# EasyEDA Pro project STLINK1.eprj

# Schematic 自制ST-LINK V2-1（开源版本）
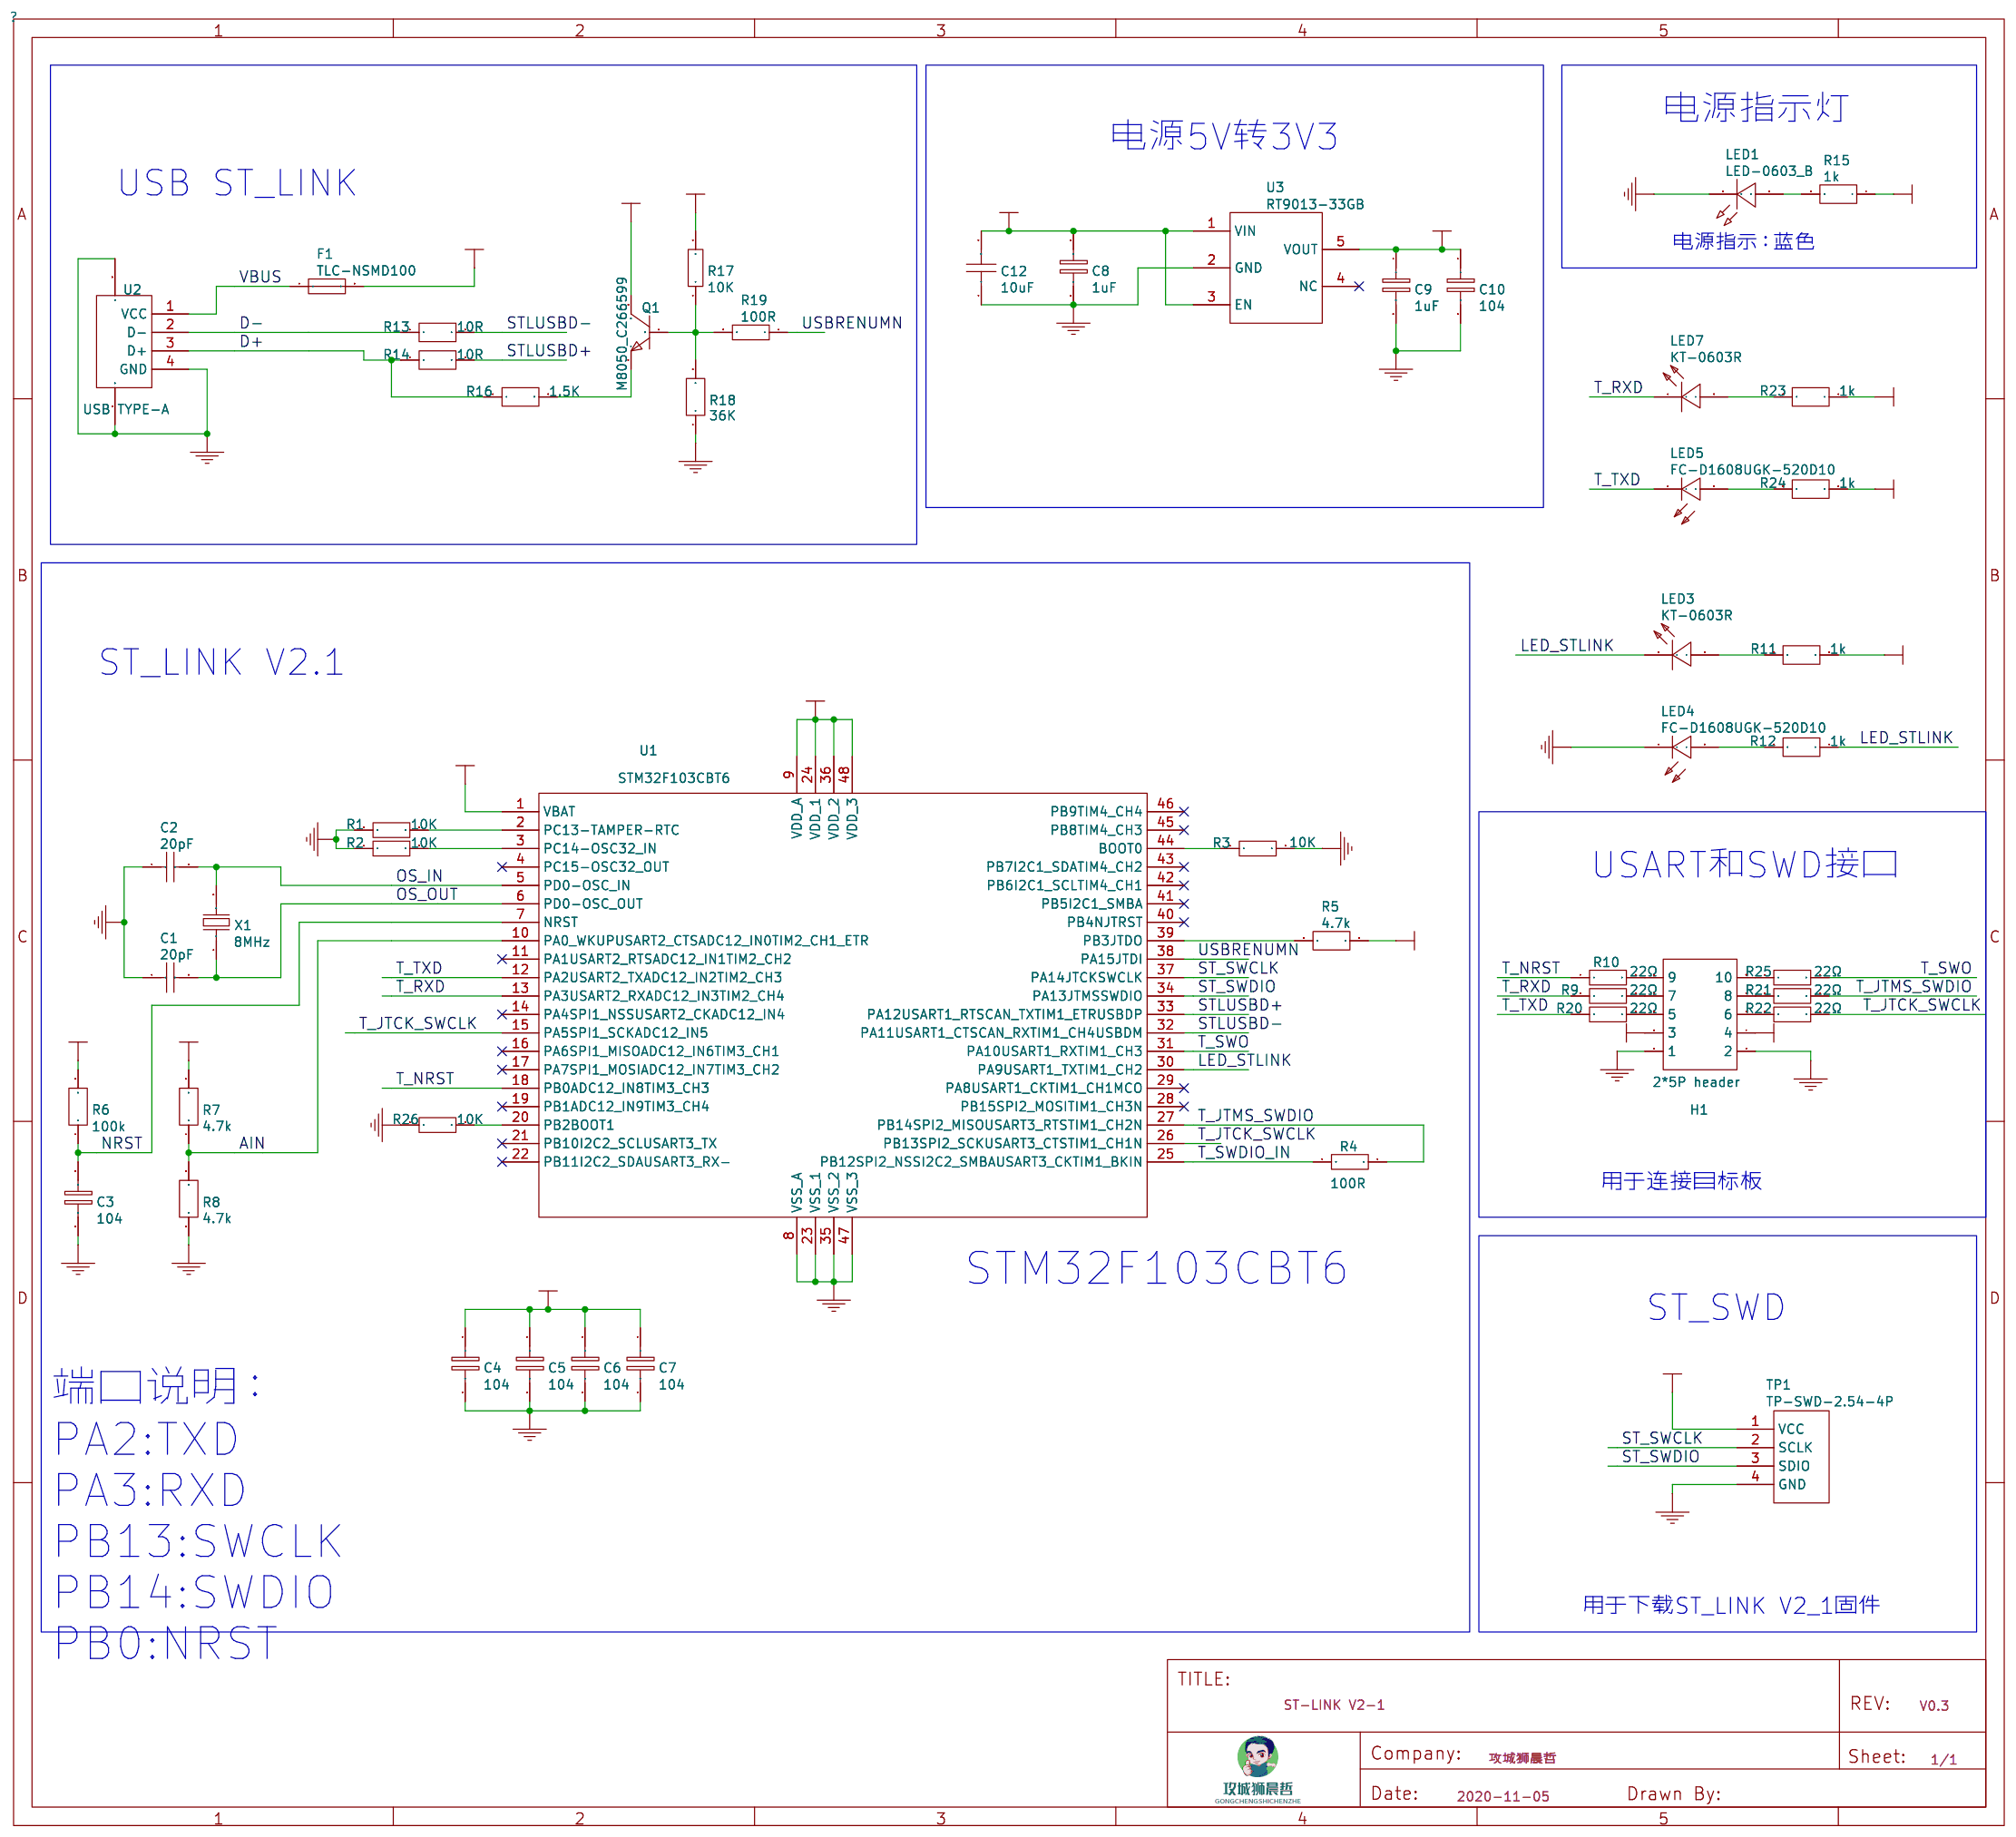
[diagram p0: schematic sheet]

## Parts
C1  20pF  [C0603]
C2  20pF  [C0603]
C3  104  [C0603]
C4  104  [C0603]
C5  104  [C0603]
C6  104  [C0603]
C7  104  [C0603]
C8  1uF  [C0603]
C9  1uF  [C0603]
C10  104  [C0603]
C12  10uF  [C0603]
F1  TLC-NSMD100  [R1206]
H1  2*5P header
LED1  LED-0603_B  [LED0603_BLUE]
LED3  KT-0603R  [LED0603-RD]
LED4  FC-D1608UGK-520D10  [LED0603-RD]
LED5  FC-D1608UGK-520D10  [LED0603-RD]
LED7  KT-0603R  [LED0603-RD]
Q1  M8050_C266599
R1  10K  [R0603]
R2  10K  [R0603]
R3  10K  [R0603]
R4  100R  [R0603]
R5  4.7k  [R0603]
R6  100k  [R0603]
R7  4.7k  [R0603]
R8  4.7k  [R0603]
R9  22Ω  [R0603]
R10  22Ω  [R0603]
R11  1k  [R0603]
R12  1k  [R0603]
R13  10R  [R0603]
R14  10R  [R0603]
R15  1k  [R0603]
R16  1.5K  [R0603]
R17  10K  [R0603]
R18  36K  [R0603]
R19  100R  [R0603]
R20  22Ω  [R0603]
R21  22Ω  [R0603]
R22  22Ω  [R0603]
R23  1k  [R0603]
R24  1k  [R0603]
R25  22Ω  [R0603]
R26  10K  [R0603]
TP1  TP-SWD-2.54-4P
U1  STM32F103CBT6
U2  USB TYPE-A
U3  RT9013-33GB  [SOT-23-5_L3.0-W1.7-P0.95-LS2.8-BR]
X1  8MHz  [OSC-SMD_L5.0-W3.2]

## Library data of the parts
C1 C2 = 20pF: Supplier: LCSC; Manufacturer Part: CL10C220JB8NNNC; Manufacturer: SAMSUNG; Supplier Part: C1653; JLCPCB Part Class: Basic
C3-C7 C10 = 104: Manufacturer Part: AC0603KRX7R9BB104; Supplier: LCSC; Manufacturer: YAGEO; Supplier Part: C149620
C8 = 1uF: Supplier: LCSC; Manufacturer: YAGEO; Supplier Part: C14664
C9 = 1uF: Manufacturer Part: CC0603KRX5R8BB105; Supplier: LCSC; Manufacturer: YAGEO; Supplier Part: C14664
C12 = 10uF: Supplier: LCSC; Manufacturer: SAMSUNG(三星); Manufacturer Part: CL10A106MA8NRNC; Supplier Part: C96446; JLCPCB Part Class: Basic Part
F1 = TLC-NSMD100: Supplier: LCSC; Supplier Part: C261954; Manufacturer: TLC Electronic
H1 = 2*5P header: Supplier: LCSC; Manufacturer: MINTRON; Manufacturer Part: MTP125-205R1; image: //image.lceda.cn/szlcsc/C60563.jpg; Supplier Part: C358707
LED1 = LED-0603_B: Manufacturer: EVERLIGHT(台湾亿光); Manufacturer Part: 19-217/BHC-ZL1M2RY/3T; Supplier Part: C72041; Supplier: LCSC
LED3 LED7 = KT-0603R: Supplier: LCSC; Manufacturer: KENTO; Supplier Part: C2286; JLCPCB Part Class: Basic Part
LED4 LED5 = FC-D1608UGK-520D10: Supplier: LCSC; Manufacturer: 国星光电; Manufacturer Part: NCD0603G1; Supplier Part: C84267; JLCPCB Part Class: Extended Part
Q1 = M8050_C266599: Supplier: LCSC; Supplier Part: C266599; Manufacturer: Bourne Semicon (Shenzhen); Manufacturer Part: M8050; JLCPCB Part Class: Extend
R1-R3 R17 R26 = 10K: Supplier: LCSC; Manufacturer: YAGEO; Manufacturer Part: AC0603FR-0710KL; Supplier Part: C116677
R4 R19 = 100R: Supplier: LCSC; Supplier Part: C105588; Manufacturer: YAGEO; Manufacturer Part: RC0603FR-07100RL
R5 R7 R8 = 4.7k: Manufacturer Part: AC0603FR-074K7L; Supplier: LCSC; Manufacturer: YAGEO; Supplier Part: C116697
R6 = 100k: Manufacturer Part: AC0603FR-07100KL; Supplier: LCSC; Manufacturer: YAGEO; Supplier Part: C116674
R9 R10 R20-R22 R25 = 22Ω: Supplier: LCSC; Manufacturer: UNI-ROYAL(厚声); Manufacturer Part: 0603WAF220JT5E; Supplier Part: C23345; JLCPCB Part Class: Basic Part
R11 R12 R15 R23 R24 = 1k: Manufacturer Part: RC0603FR-071KL; Supplier: LCSC; Manufacturer: YAGEO; Supplier Part: C22548
R13 R14 = 10R: Manufacturer Part: RC0603FR-0710RL; Supplier: LCSC; Manufacturer: YAGEO; Supplier Part: C109318
R16 = 1.5K: Manufacturer Part: RC0603FR-071K5L; Supplier: LCSC; Manufacturer: YAGEO; Supplier Part: C114668
R18 = 36K: Manufacturer Part: AC0603FR-0736KL; Supplier: LCSC; Manufacturer: YAGEO; Supplier Part: C227841
TP1 = TP-SWD-2.54-4P
U1 = STM32F103CBT6: Supplier: LCSC; Manufacturer: STMicroelectronics; image: //image.lceda.cn/szlcsc/C8304.jpg; Supplier Part: C8304; JLCPCB Part Class: Basic
U2 = USB TYPE-A: Manufacturer: SOFNG; Manufacturer Part: USB-05; Supplier Part: C112454; Supplier: LCSC; link: https://item.szlcsc.com/10269.html
U3 = RT9013-33GB: Supplier: LCSC; Manufacturer: RICHTEK; image: //image.lceda.cn/szlcsc/C47773.jpg; Supplier Part: C47773; JLCPCB Part Class: Extend
X1 = 8MHz: Supplier: LCSC; Manufacturer: TXC; Manufacturer Part: 7A0808LCSC-AHK2G; Supplier Part: C111120; JLCPCB Part Class: Extend

## Nets
3V3: C4.1 C5.1 C6.1 C7.1 C9.1 C10.1 H1.3 H1.4 Q1.3(C) R5.1 R6.2 R7.2 R11.1 R15.1 R23.1 R24.1 TP1.1(VCC) U1.1(VBAT) U1.9(VDD_A) U1.24(VDD_1) U1.36(VDD_2) U1.48(VDD_3) U3.5(VOUT)
+5V: C8.1 C12.2 F1.2 R17.2 U3.1(VIN) U3.3(EN)
GND: C1.1 C2.1 C3.2 C4.2 C5.2 C6.2 C7.2 C8.2 C9.2 C10.2 C12.1 H1.1 H1.2 LED1.2 LED4.1(K) R1.1 R2.1 R3.2 R8.1 R18.1 R26.1 TP1.4(GND) U1.8(VSS_A) U1.23(VSS_1) U1.35(VSS_2) U1.47(VSS_3) U2.4(GND) U2.5 U2.6 U3.2(GND)
VBUS: F1.1 U2.1(VCC)
AIN: R7.1 R8.2 U1.10(PA0_WKUPUSART2_CTSADC12_IN0TIM2_CH1_ETR)
D+: R14.1 R16.1 U2.3(D+)
D-: R13.1 U2.2(D-)
LED_STLINK: LED3.1(K) R12.1 U1.30(PA9USART1_TXTIM1_CH2)
NRST: C3.1 R6.1 U1.7(NRST)
OS_IN: C2.2 U1.5(PD0-OSC_IN) X1.2
OS_OUT: C1.2 U1.6(PD0-OSC_OUT) X1.1
ST_SWCLK: TP1.2(SCLK) U1.37(PA14JTCKSWCLK)
ST_SWDIO: TP1.3(SDIO) U1.34(PA13JTMSSWDIO)
STLUSBD+: R14.2 U1.33(PA12USART1_RTSCAN_TXTIM1_ETRUSBDP)
STLUSBD-: R13.2 U1.32(PA11USART1_CTSCAN_RXTIM1_CH4USBDM)
T_JTCK_SWCLK: R22.2 U1.15(PA5SPI1_SCKADC12_IN5) U1.26(PB13SPI2_SCKUSART3_CTSTIM1_CH1N)
T_JTMS_SWDIO: R4.1 R21.2 U1.27(PB14SPI2_MISOUSART3_RTSTIM1_CH2N)
T_NRST: R10.1 U1.18(PB0ADC12_IN8TIM3_CH3)
T_RXD: LED7.1(K) R9.1 U1.13(PA3USART2_RXADC12_IN3TIM2_CH4)
T_SWDIO_IN: R4.2 U1.25(PB12SPI2_NSSI2C2_SMBAUSART3_CKTIM1_BKIN)
T_SWO: R25.2 U1.31(PA10USART1_RXTIM1_CH3)
T_TXD: LED5.1(K) R20.1 U1.12(PA2USART2_TXADC12_IN2TIM2_CH3)
USBRENUMN: R19.1 U1.38(PA15JTDI)
Net-(H1-5): H1.5 R20.2
Net-(H1-6): H1.6 R22.1
Net-(H1-7): H1.7 R9.2
Net-(H1-8): H1.8 R21.1
Net-(H1-9): H1.9 R10.2
Net-(H1-10): H1.10 R25.1
Net-(LED1-1): LED1.1 R15.2
Net-(LED3-2): LED3.2(A) R11.2
Net-(LED4-2): LED4.2(A) R12.2
Net-(LED5-2): LED5.2(A) R24.2
Net-(LED7-2): LED7.2(A) R23.2
Net-(Q1-1): Q1.1(B) R17.1 R18.2 R19.2
Net-(Q1-2): Q1.2(E) R16.2
Net-(R1-2): R1.2 U1.2(PC13-TAMPER-RTC)
Net-(R2-2): R2.2 U1.3(PC14-OSC32_IN)
Net-(R3-1): R3.1 U1.44(BOOT0)
Net-(R5-2): R5.2 U1.39(PB3JTDO)
Net-(R26-2): R26.2 U1.20(PB2BOOT1)

Not connected (* = marked no-connect by the designer): U1 4(PC15-OSC32_OUT)* 11(PA1USART2_RTSADC12_IN1TIM2_CH2)* 14(PA4SPI1_NSSUSART2_CKADC12_IN4)* 16(PA6SPI1_MISOADC12_IN6TIM3_CH1)* 17(PA7SPI1_MOSIADC12_IN7TIM3_CH2)* 19(PB1ADC12_IN9TIM3_CH4)* 21(PB10I2C2_SCLUSART3_TX)* 22(PB11I2C2_SDAUSART3_RX-)* 28(PB15SPI2_MOSITIM1_CH3N)* 29(PA8USART1_CKTIM1_CH1MCO)* 40(PB4NJTRST)* 41(PB5I2C1_SMBA)* 42(PB6I2C1_SCLTIM4_CH1)* 43(PB7I2C1_SDATIM4_CH2)* 45(PB8TIM4_CH3)* 46(PB9TIM4_CH4)*; U3 4(NC)*

## Notes on the sheet
- 电源指示灯
- 电源5V转3V3
- USB ST_LINK
- 电源指示：蓝色
- ST_LINK V2.1
- USART和SWD接口
- 用于连接目标板
- STM32F103CBT6
- ST_SWD
- 端口说明：
  PA2:TXD
  PA3:RXD
  PB13:SWCLK
  PB14:SWDIO
  PB0:NRST
- 用于下载ST_LINK V2_1固件
